# Altium schematic sheet main.SchDoc (part 1 of 3)
size E; SheetNumber: 1; SheetTotal: 2
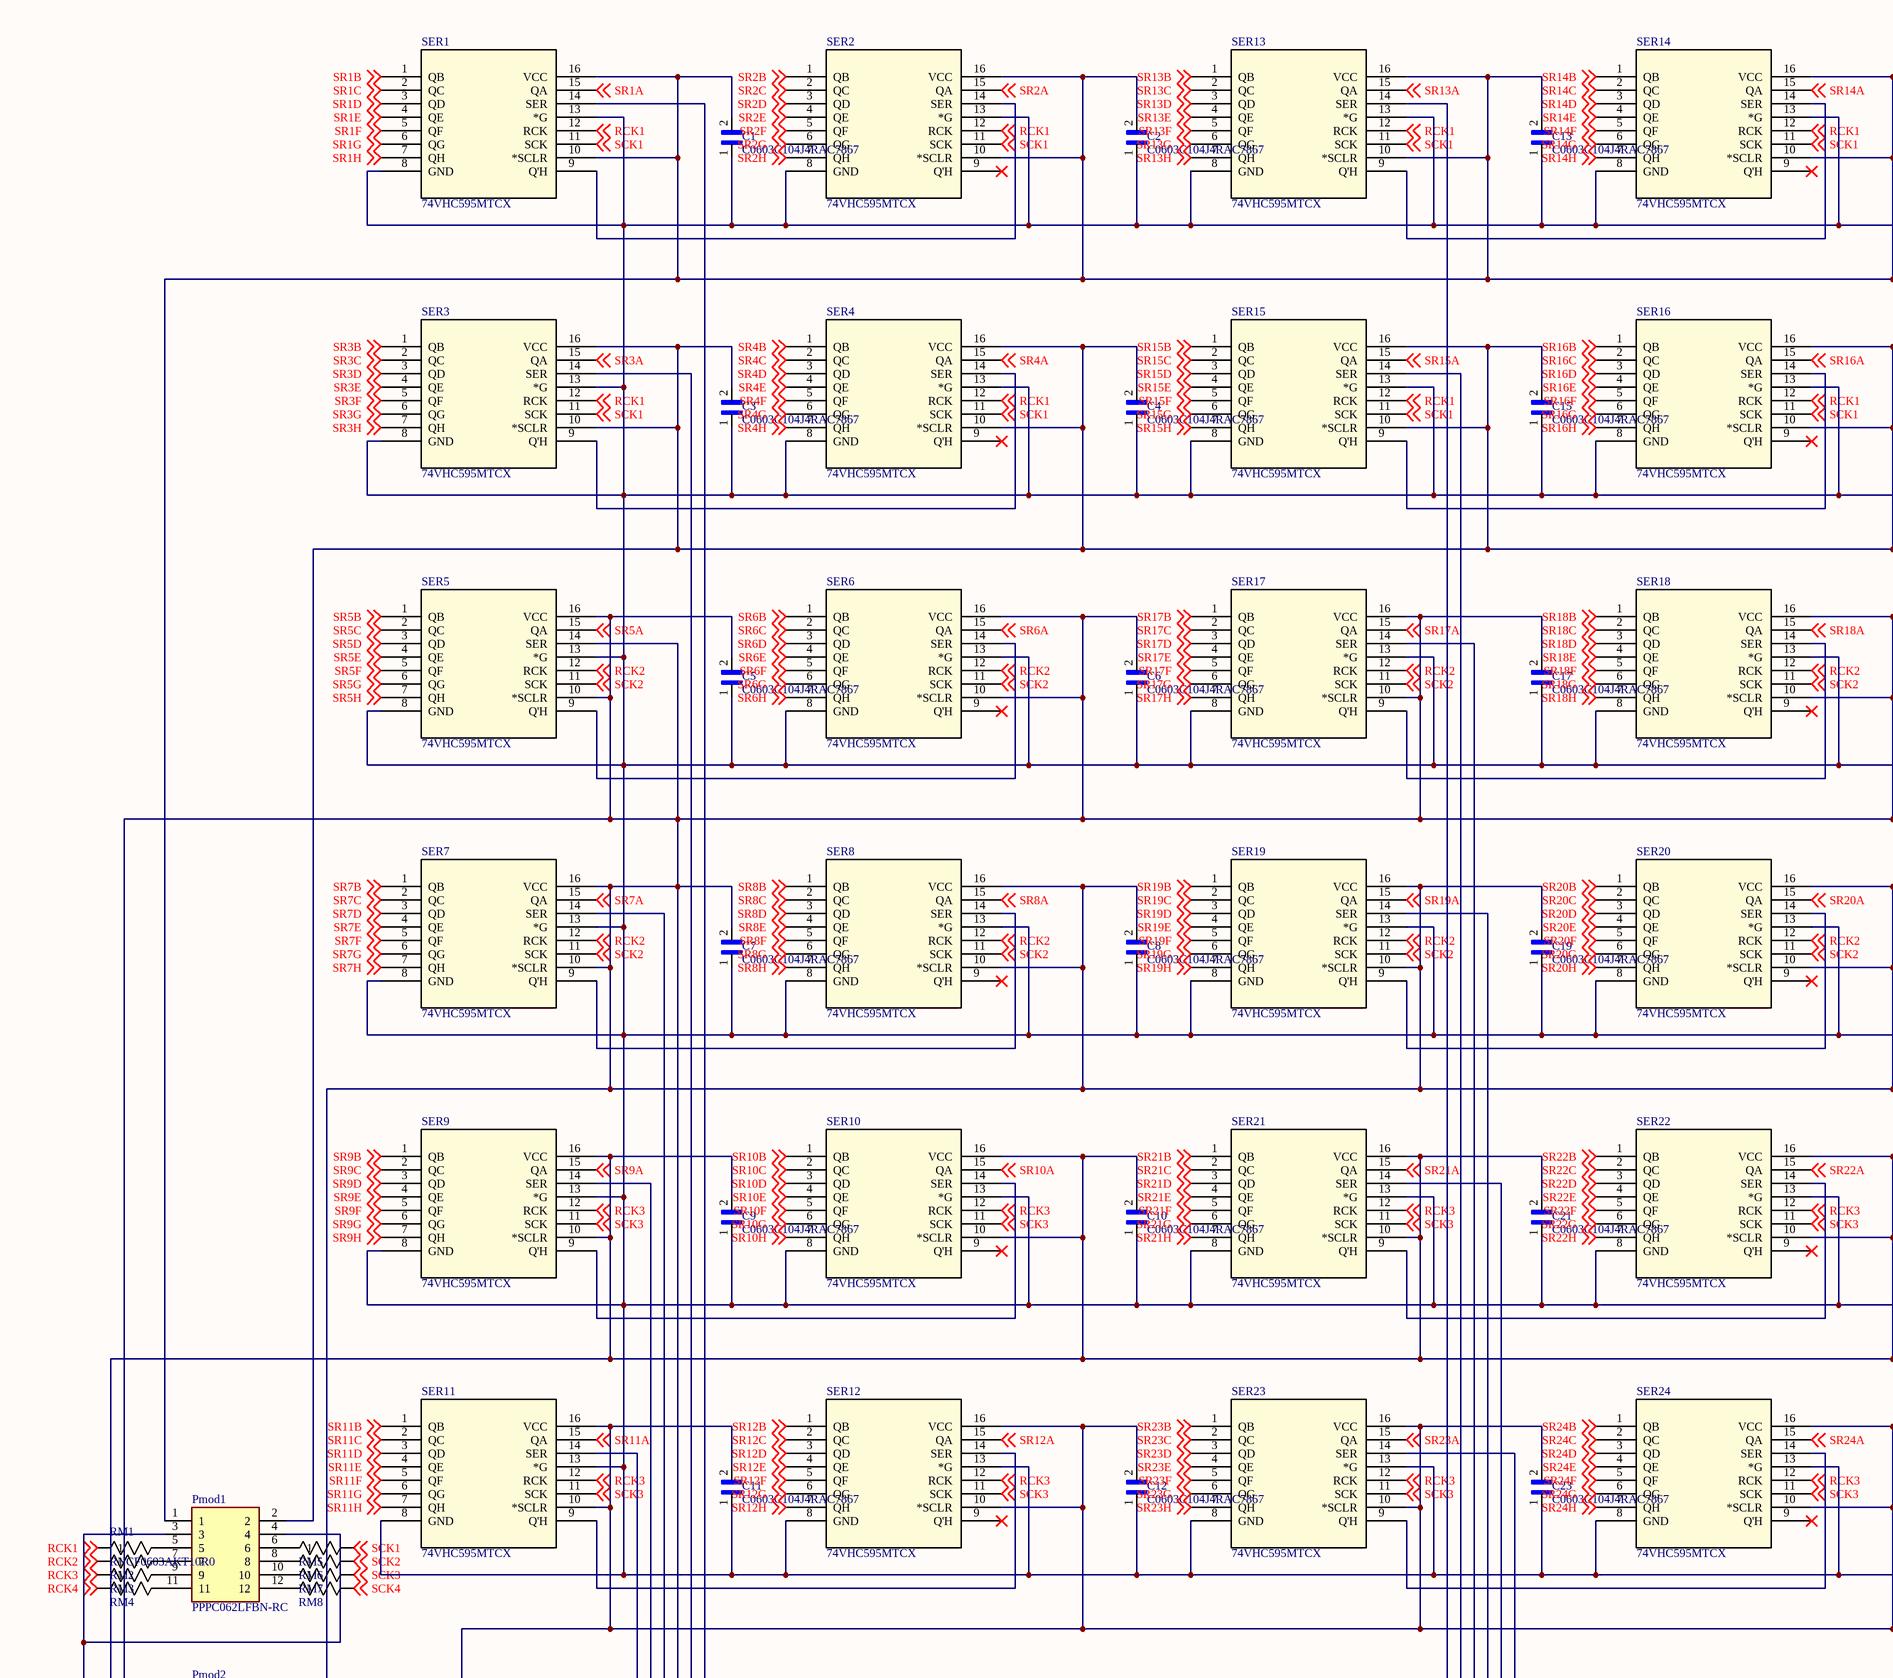
[diagram p0: main.SchDoc, top left]
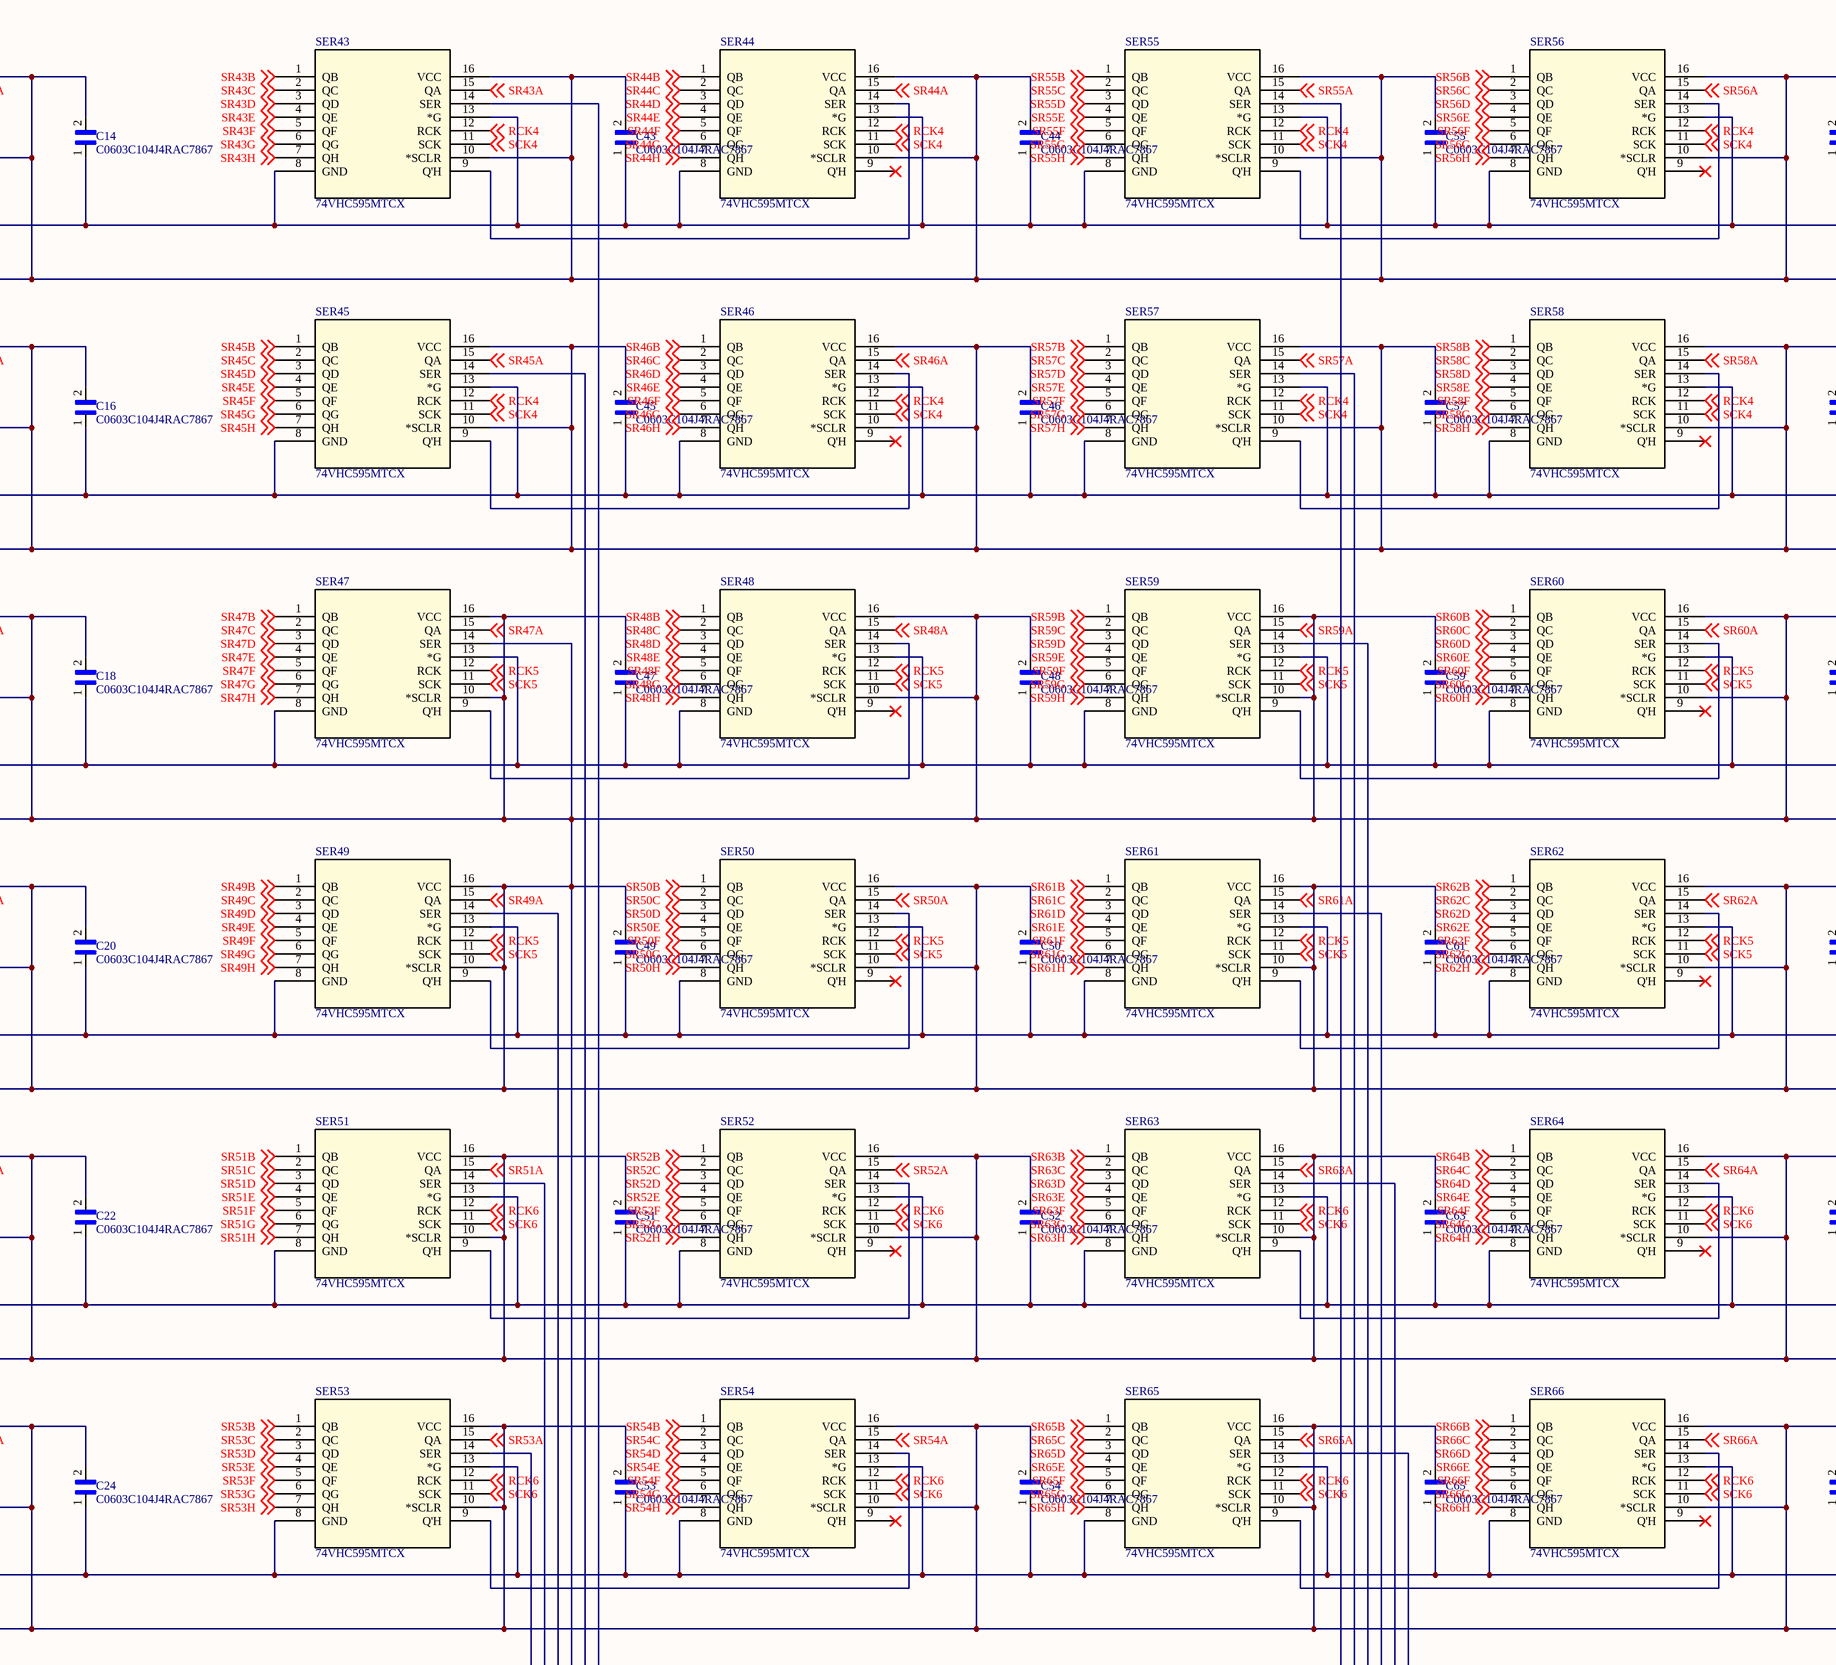
[diagram p1: main.SchDoc, top middle]
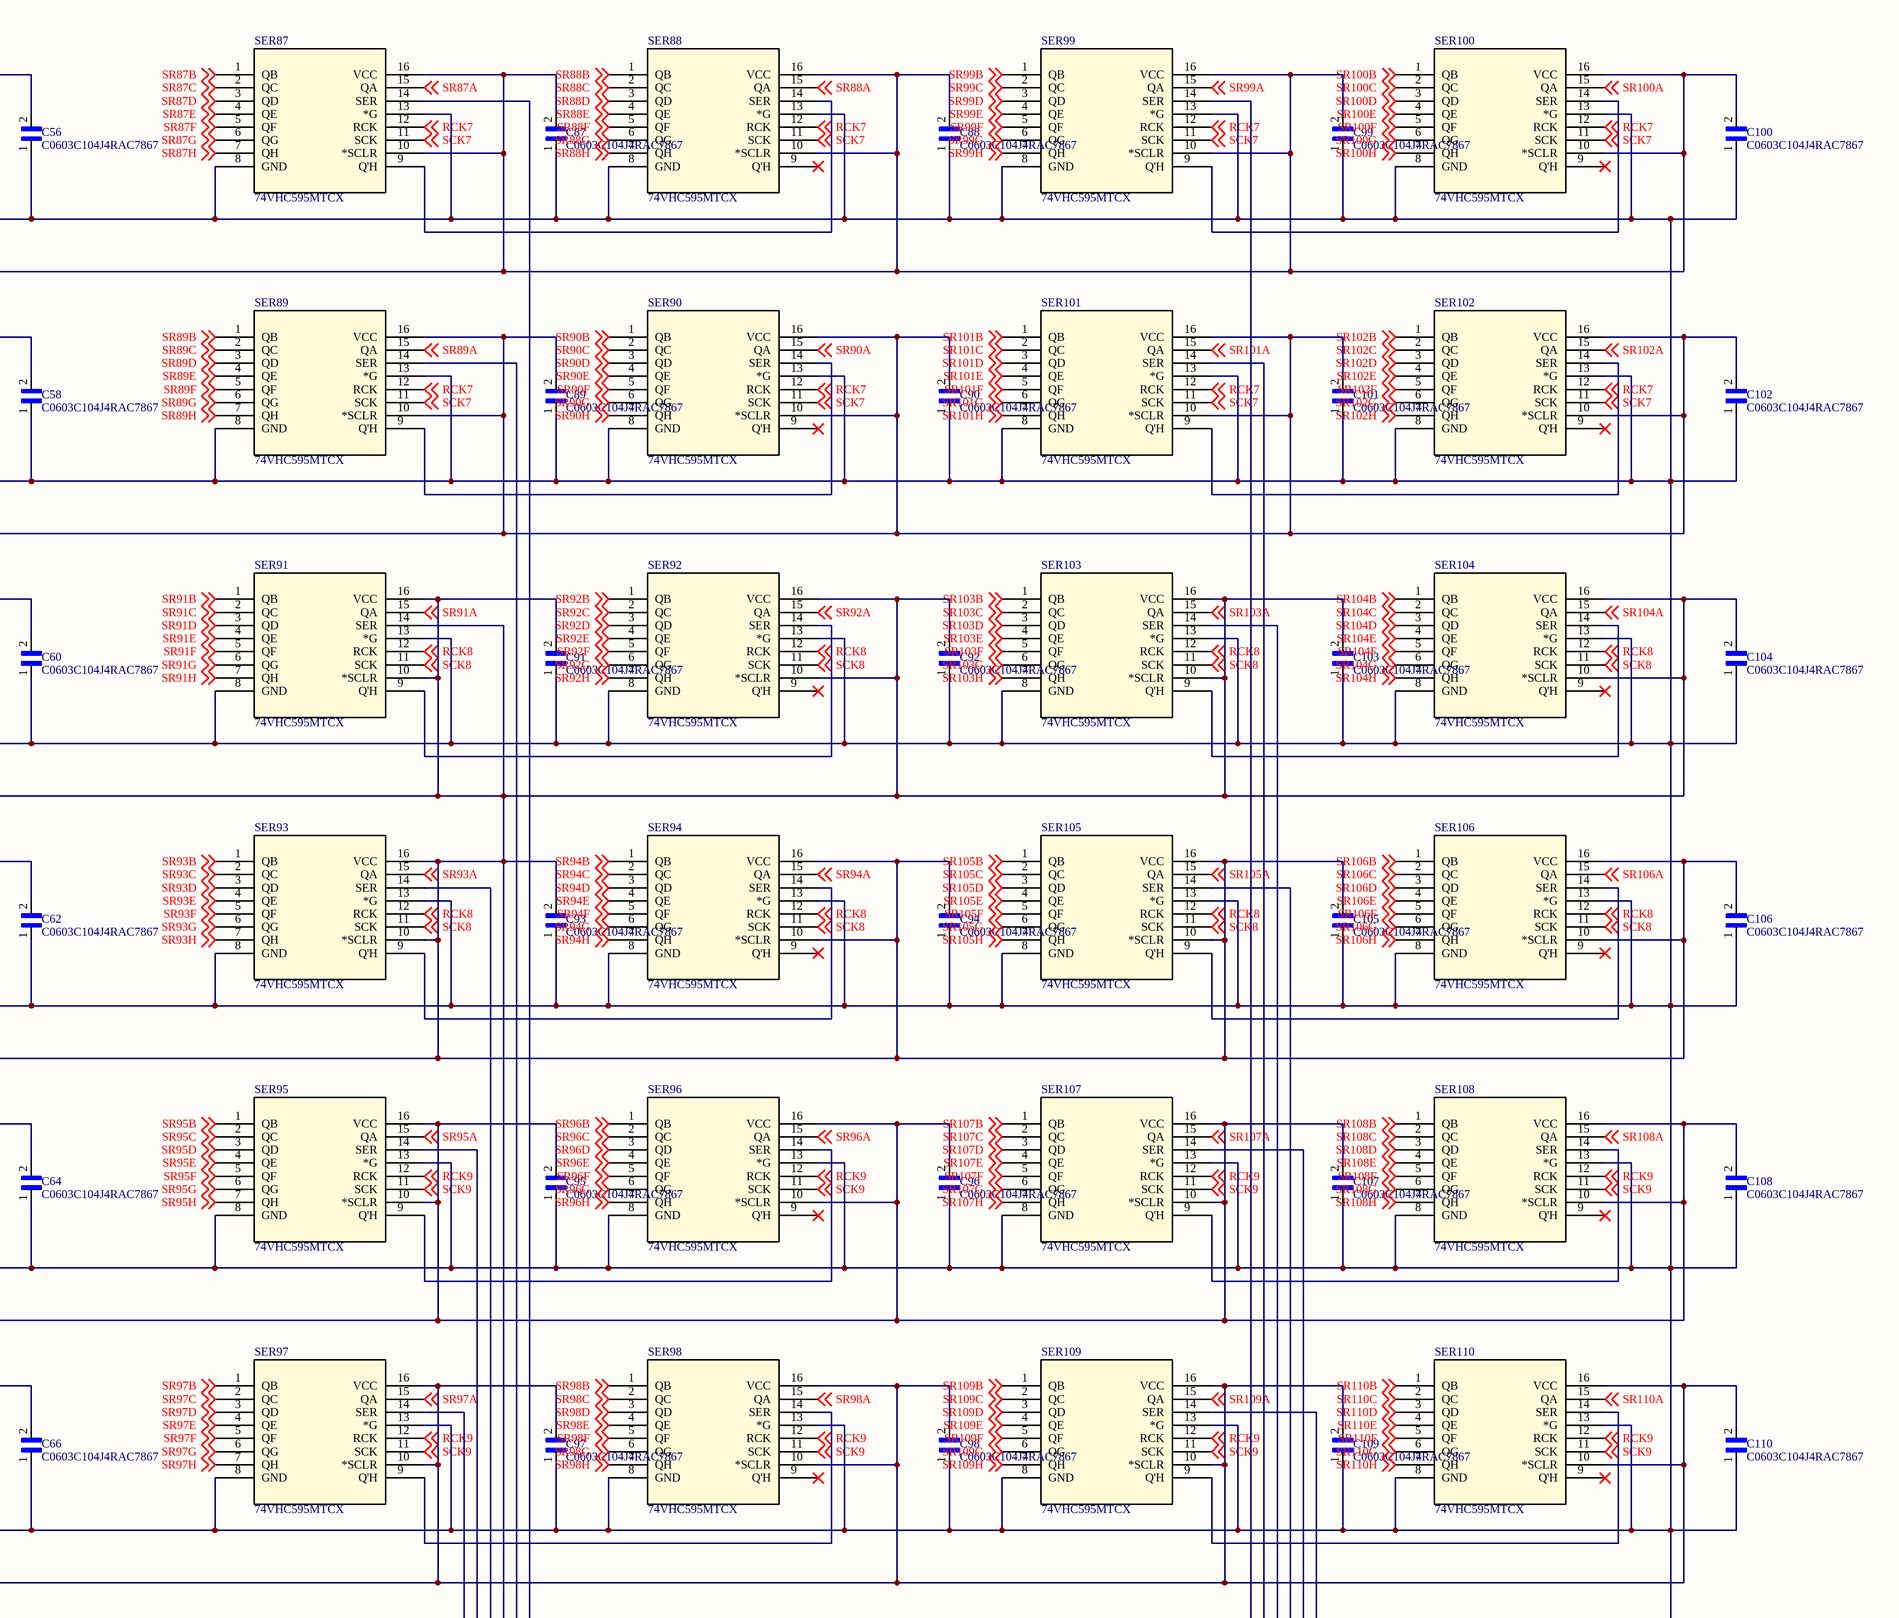
[diagram p2: main.SchDoc, top right]
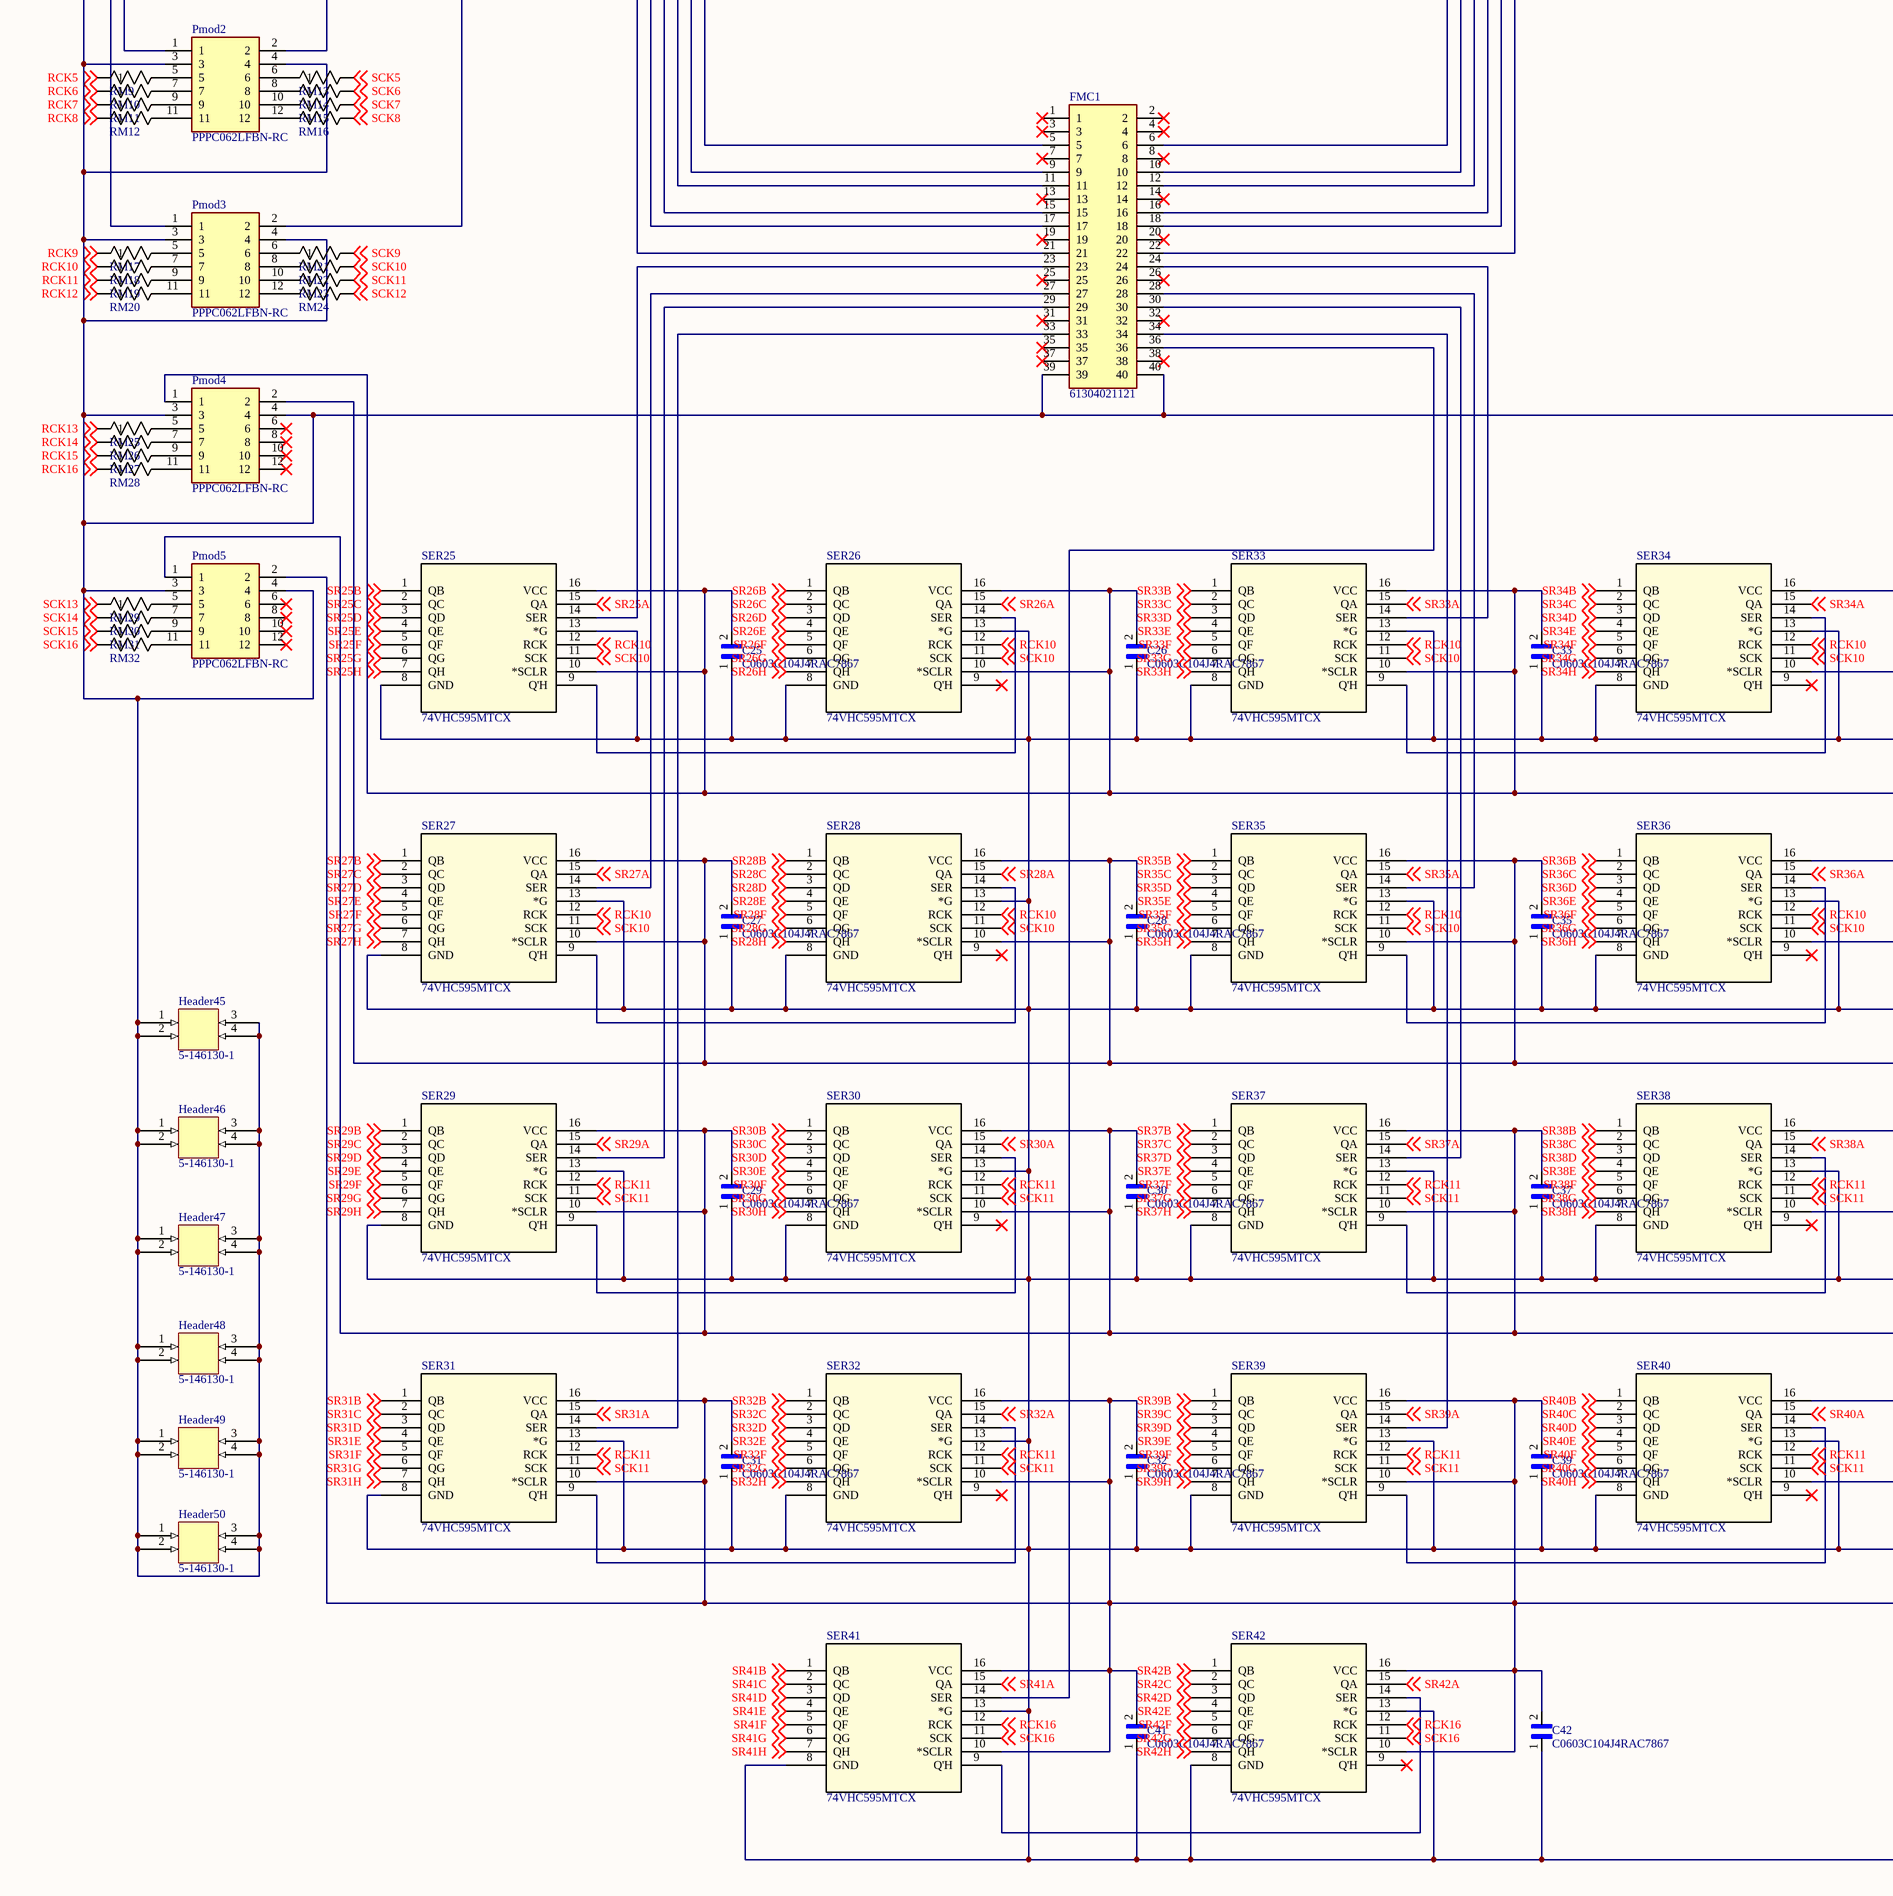
[diagram p3: main.SchDoc, bottom left]
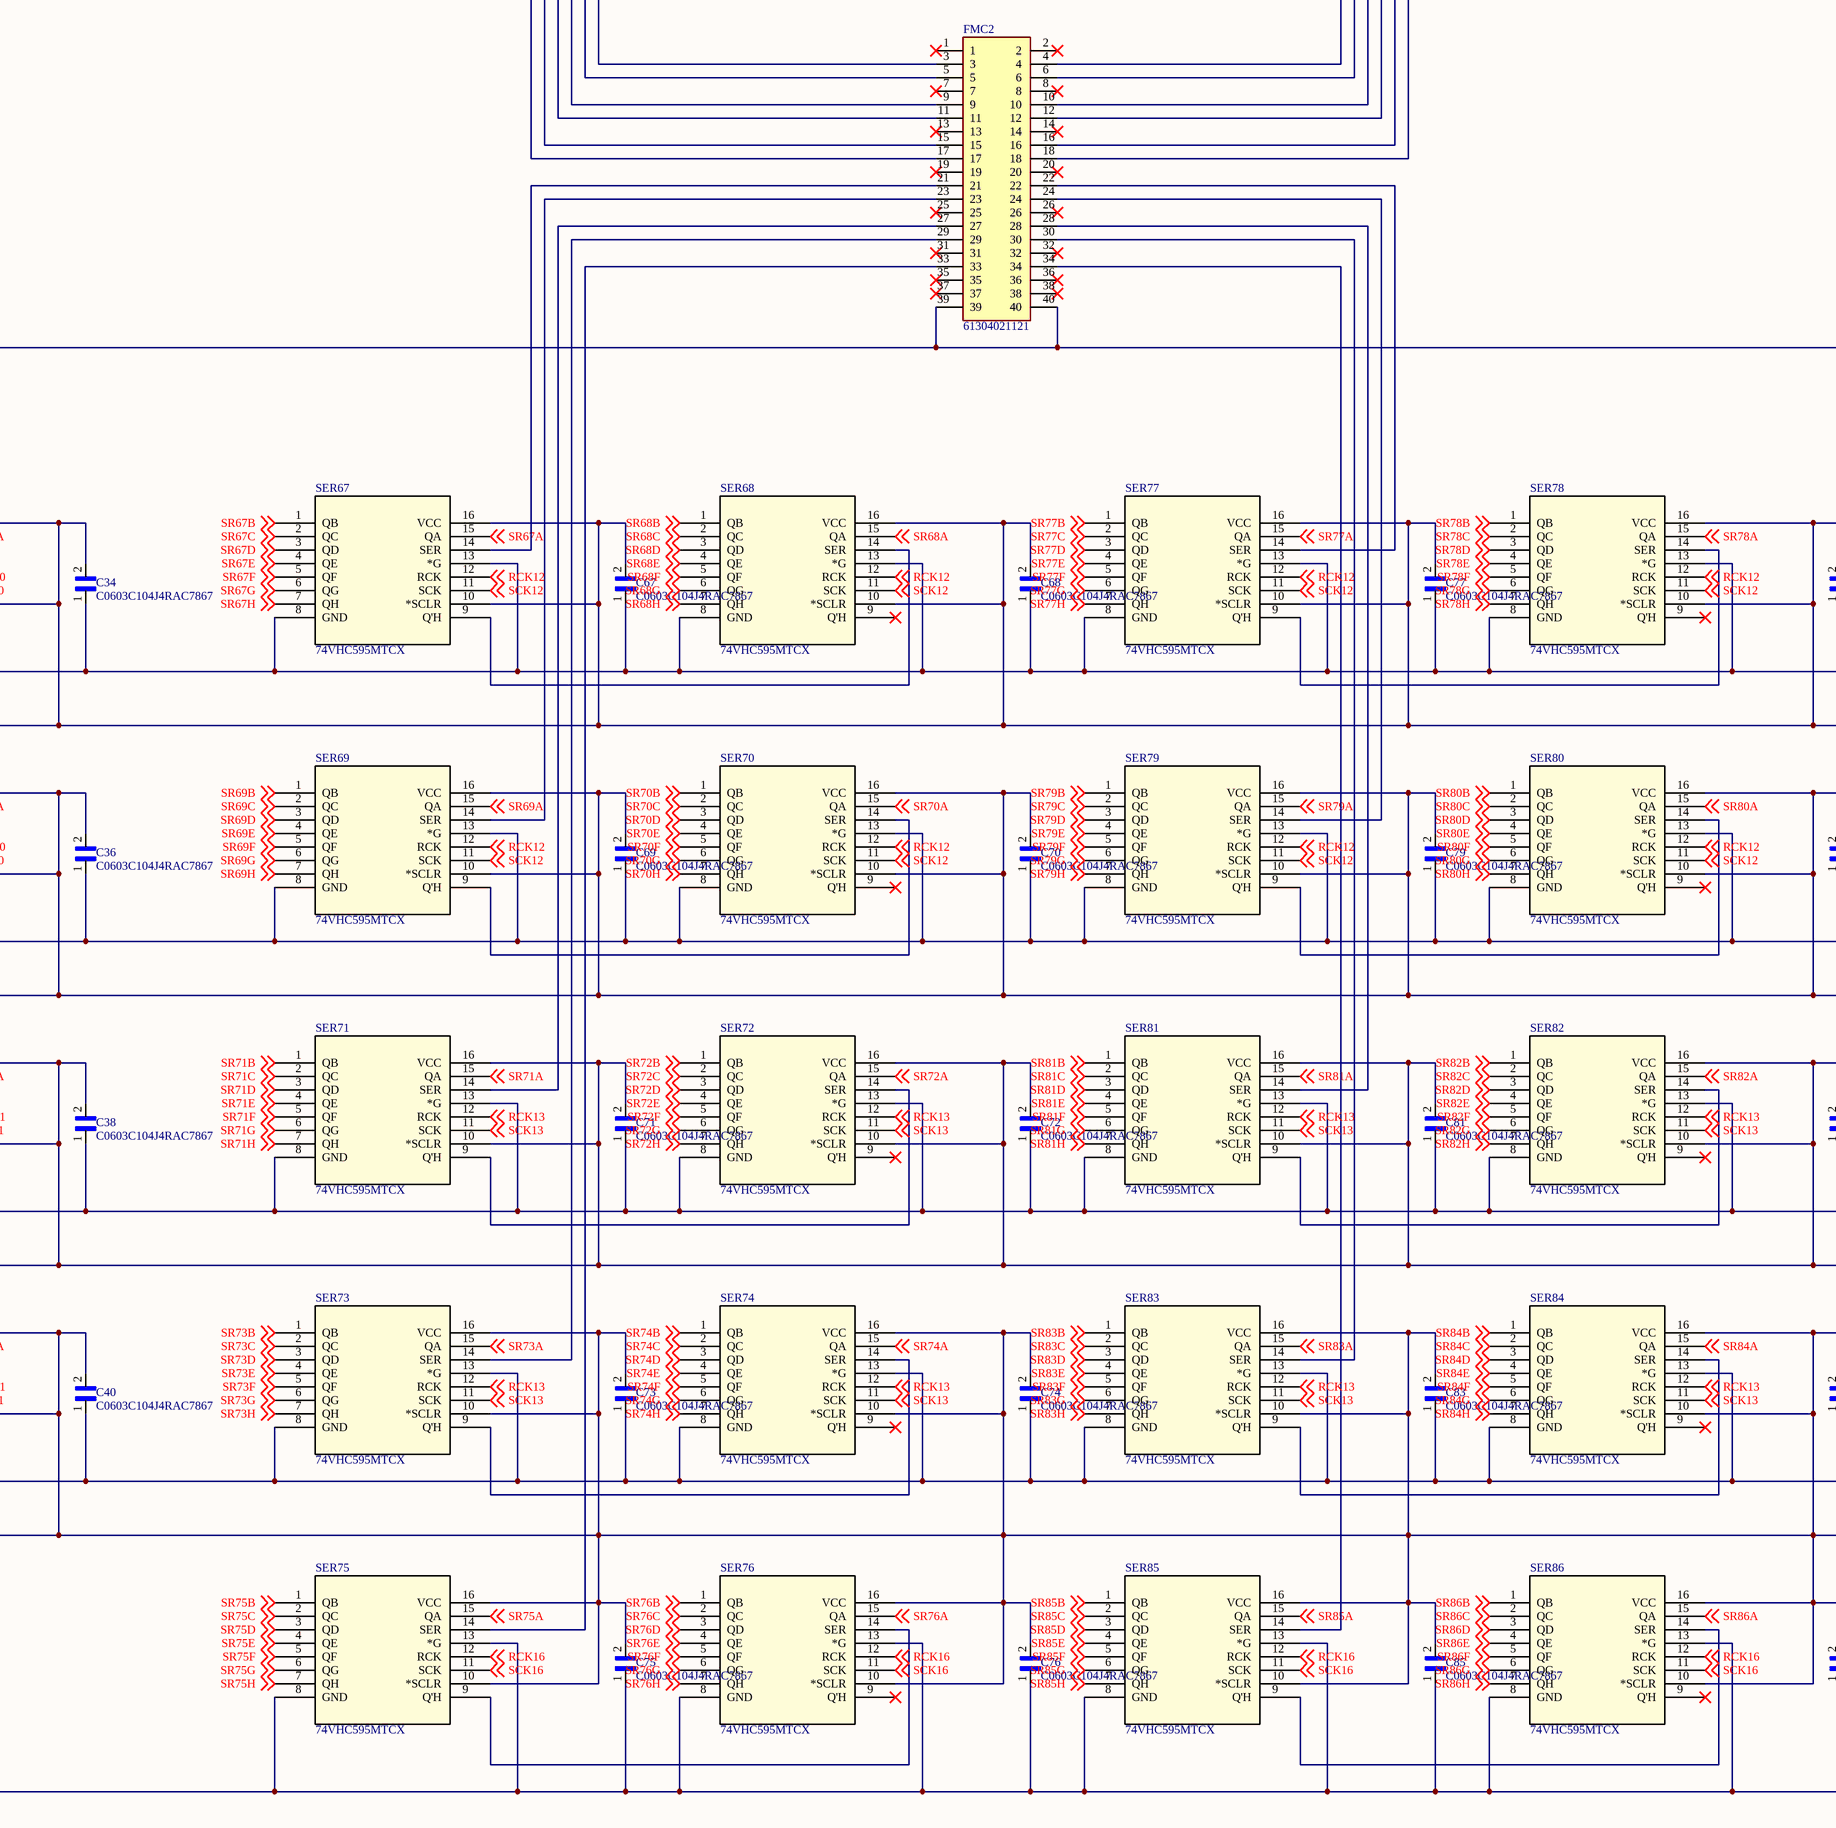
[diagram p4: main.SchDoc, bottom middle]
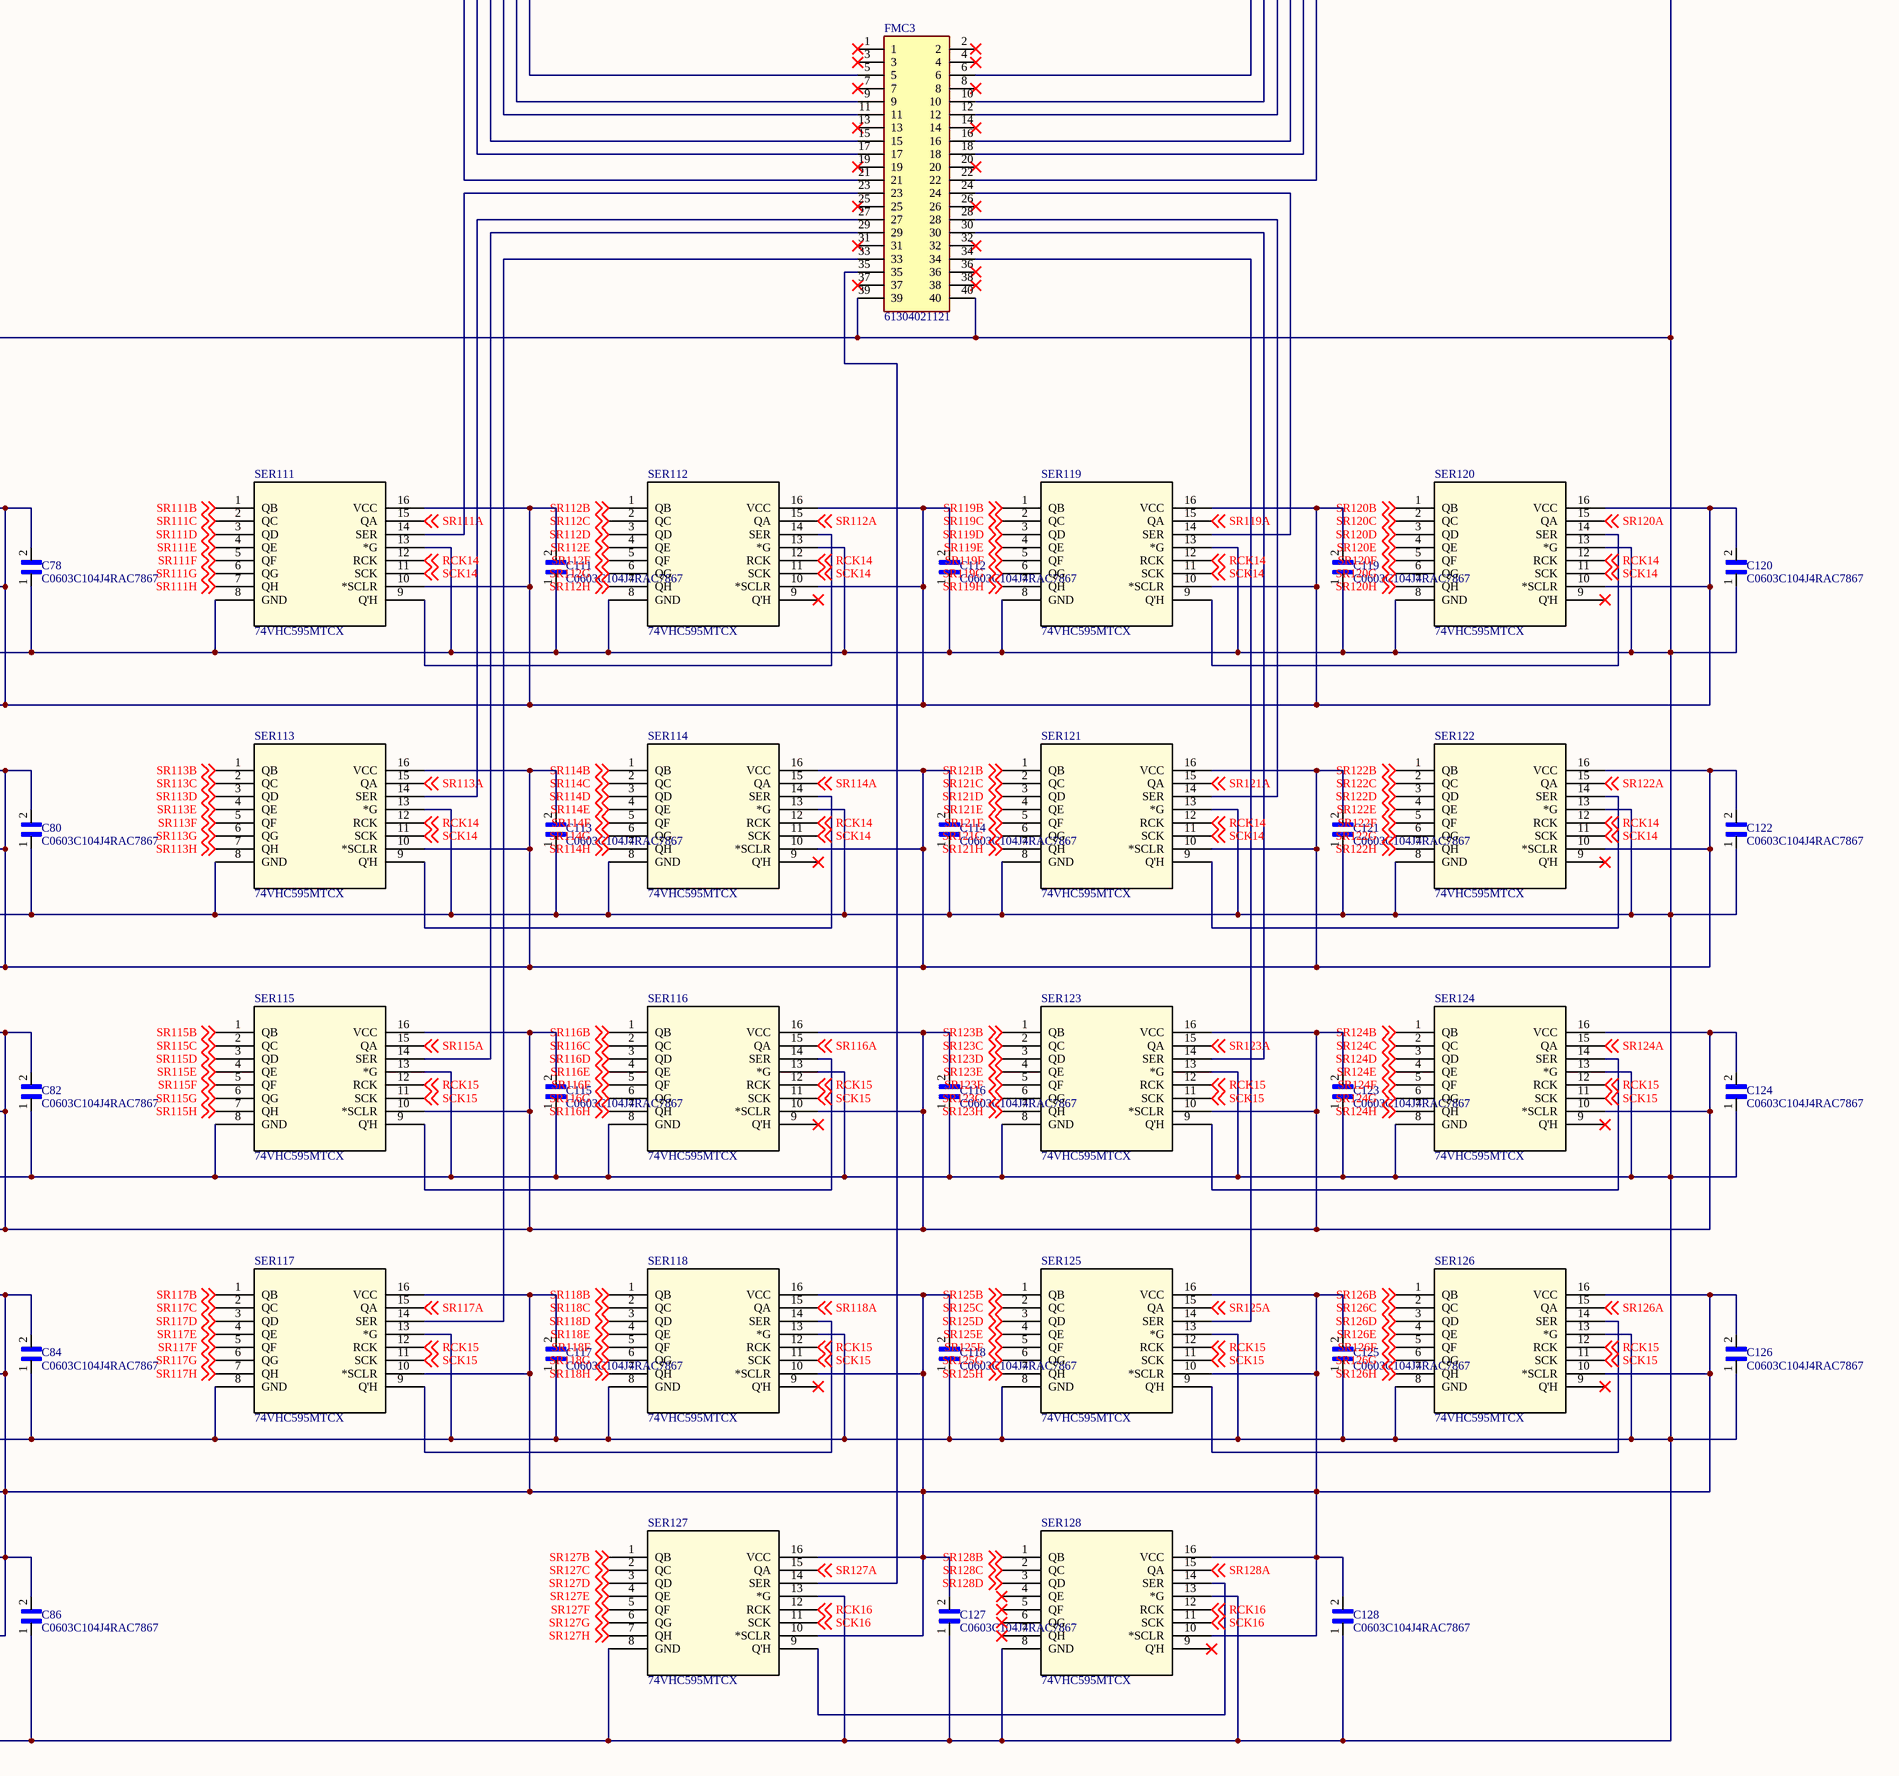
[diagram p5: main.SchDoc, bottom right]

## Parts
C1  C0603C104J4RAC7867  [CAPC1608X90N]
C2  C0603C104J4RAC7867  [CAPC1608X90N]
C3  C0603C104J4RAC7867  [CAPC1608X90N]
C4  C0603C104J4RAC7867  [CAPC1608X90N]
C5  C0603C104J4RAC7867  [CAPC1608X90N]
C6  C0603C104J4RAC7867  [CAPC1608X90N]
C7  C0603C104J4RAC7867  [CAPC1608X90N]
C8  C0603C104J4RAC7867  [CAPC1608X90N]
C9  C0603C104J4RAC7867  [CAPC1608X90N]
C10  C0603C104J4RAC7867  [CAPC1608X90N]
C11  C0603C104J4RAC7867  [CAPC1608X90N]
C12  C0603C104J4RAC7867  [CAPC1608X90N]
C13  C0603C104J4RAC7867  [CAPC1608X90N]
C14  C0603C104J4RAC7867  [CAPC1608X90N]
C15  C0603C104J4RAC7867  [CAPC1608X90N]
C16  C0603C104J4RAC7867  [CAPC1608X90N]
C17  C0603C104J4RAC7867  [CAPC1608X90N]
C18  C0603C104J4RAC7867  [CAPC1608X90N]
C19  C0603C104J4RAC7867  [CAPC1608X90N]
C20  C0603C104J4RAC7867  [CAPC1608X90N]
C21  C0603C104J4RAC7867  [CAPC1608X90N]
C22  C0603C104J4RAC7867  [CAPC1608X90N]
C23  C0603C104J4RAC7867  [CAPC1608X90N]
C24  C0603C104J4RAC7867  [CAPC1608X90N]
C25  C0603C104J4RAC7867  [CAPC1608X90N]
C26  C0603C104J4RAC7867  [CAPC1608X90N]
C27  C0603C104J4RAC7867  [CAPC1608X90N]
C28  C0603C104J4RAC7867  [CAPC1608X90N]
C29  C0603C104J4RAC7867  [CAPC1608X90N]
C30  C0603C104J4RAC7867  [CAPC1608X90N]
C31  C0603C104J4RAC7867  [CAPC1608X90N]
C32  C0603C104J4RAC7867  [CAPC1608X90N]
C33  C0603C104J4RAC7867  [CAPC1608X90N]
C34  C0603C104J4RAC7867  [CAPC1608X90N]
C35  C0603C104J4RAC7867  [CAPC1608X90N]
C36  C0603C104J4RAC7867  [CAPC1608X90N]
C37  C0603C104J4RAC7867  [CAPC1608X90N]
C38  C0603C104J4RAC7867  [CAPC1608X90N]
C39  C0603C104J4RAC7867  [CAPC1608X90N]
C40  C0603C104J4RAC7867  [CAPC1608X90N]
C41  C0603C104J4RAC7867  [CAPC1608X90N]
C42  C0603C104J4RAC7867  [CAPC1608X90N]
C43  C0603C104J4RAC7867  [CAPC1608X90N]
C44  C0603C104J4RAC7867  [CAPC1608X90N]
C45  C0603C104J4RAC7867  [CAPC1608X90N]
C46  C0603C104J4RAC7867  [CAPC1608X90N]
C47  C0603C104J4RAC7867  [CAPC1608X90N]
C48  C0603C104J4RAC7867  [CAPC1608X90N]
C49  C0603C104J4RAC7867  [CAPC1608X90N]
C50  C0603C104J4RAC7867  [CAPC1608X90N]
C51  C0603C104J4RAC7867  [CAPC1608X90N]
C52  C0603C104J4RAC7867  [CAPC1608X90N]
C53  C0603C104J4RAC7867  [CAPC1608X90N]
C54  C0603C104J4RAC7867  [CAPC1608X90N]
C55  C0603C104J4RAC7867  [CAPC1608X90N]
C56  C0603C104J4RAC7867  [CAPC1608X90N]
C57  C0603C104J4RAC7867  [CAPC1608X90N]
C58  C0603C104J4RAC7867  [CAPC1608X90N]
C59  C0603C104J4RAC7867  [CAPC1608X90N]
C60  C0603C104J4RAC7867  [CAPC1608X90N]
C61  C0603C104J4RAC7867  [CAPC1608X90N]
C62  C0603C104J4RAC7867  [CAPC1608X90N]
C63  C0603C104J4RAC7867  [CAPC1608X90N]
C64  C0603C104J4RAC7867  [CAPC1608X90N]
C65  C0603C104J4RAC7867  [CAPC1608X90N]
C66  C0603C104J4RAC7867  [CAPC1608X90N]
C67  C0603C104J4RAC7867  [CAPC1608X90N]
C68  C0603C104J4RAC7867  [CAPC1608X90N]
C69  C0603C104J4RAC7867  [CAPC1608X90N]
C70  C0603C104J4RAC7867  [CAPC1608X90N]
C71  C0603C104J4RAC7867  [CAPC1608X90N]
C72  C0603C104J4RAC7867  [CAPC1608X90N]
C73  C0603C104J4RAC7867  [CAPC1608X90N]
C74  C0603C104J4RAC7867  [CAPC1608X90N]
C75  C0603C104J4RAC7867  [CAPC1608X90N]
C76  C0603C104J4RAC7867  [CAPC1608X90N]
C77  C0603C104J4RAC7867  [CAPC1608X90N]
C78  C0603C104J4RAC7867  [CAPC1608X90N]
C79  C0603C104J4RAC7867  [CAPC1608X90N]
C80  C0603C104J4RAC7867  [CAPC1608X90N]
C81  C0603C104J4RAC7867  [CAPC1608X90N]
C82  C0603C104J4RAC7867  [CAPC1608X90N]
C83  C0603C104J4RAC7867  [CAPC1608X90N]
C84  C0603C104J4RAC7867  [CAPC1608X90N]
C85  C0603C104J4RAC7867  [CAPC1608X90N]
C86  C0603C104J4RAC7867  [CAPC1608X90N]
C87  C0603C104J4RAC7867  [CAPC1608X90N]
C88  C0603C104J4RAC7867  [CAPC1608X90N]
C89  C0603C104J4RAC7867  [CAPC1608X90N]
C90  C0603C104J4RAC7867  [CAPC1608X90N]
C91  C0603C104J4RAC7867  [CAPC1608X90N]
C92  C0603C104J4RAC7867  [CAPC1608X90N]
C93  C0603C104J4RAC7867  [CAPC1608X90N]
C94  C0603C104J4RAC7867  [CAPC1608X90N]
C95  C0603C104J4RAC7867  [CAPC1608X90N]
C96  C0603C104J4RAC7867  [CAPC1608X90N]
C97  C0603C104J4RAC7867  [CAPC1608X90N]
C98  C0603C104J4RAC7867  [CAPC1608X90N]
C99  C0603C104J4RAC7867  [CAPC1608X90N]
C100  C0603C104J4RAC7867  [CAPC1608X90N]
C101  C0603C104J4RAC7867  [CAPC1608X90N]
C102  C0603C104J4RAC7867  [CAPC1608X90N]
C103  C0603C104J4RAC7867  [CAPC1608X90N]
C104  C0603C104J4RAC7867  [CAPC1608X90N]
C105  C0603C104J4RAC7867  [CAPC1608X90N]
C106  C0603C104J4RAC7867  [CAPC1608X90N]
C107  C0603C104J4RAC7867  [CAPC1608X90N]
C108  C0603C104J4RAC7867  [CAPC1608X90N]
C109  C0603C104J4RAC7867  [CAPC1608X90N]
C110  C0603C104J4RAC7867  [CAPC1608X90N]
C111  C0603C104J4RAC7867  [CAPC1608X90N]
C112  C0603C104J4RAC7867  [CAPC1608X90N]
C113  C0603C104J4RAC7867  [CAPC1608X90N]
C114  C0603C104J4RAC7867  [CAPC1608X90N]
C115  C0603C104J4RAC7867  [CAPC1608X90N]
C116  C0603C104J4RAC7867  [CAPC1608X90N]
C117  C0603C104J4RAC7867  [CAPC1608X90N]
C118  C0603C104J4RAC7867  [CAPC1608X90N]
C119  C0603C104J4RAC7867  [CAPC1608X90N]
C120  C0603C104J4RAC7867  [CAPC1608X90N]
C121  C0603C104J4RAC7867  [CAPC1608X90N]
C122  C0603C104J4RAC7867  [CAPC1608X90N]
C123  C0603C104J4RAC7867  [CAPC1608X90N]
C124  C0603C104J4RAC7867  [CAPC1608X90N]
C125  C0603C104J4RAC7867  [CAPC1608X90N]
C126  C0603C104J4RAC7867  [CAPC1608X90N]
C127  C0603C104J4RAC7867  [CAPC1608X90N]
C128  C0603C104J4RAC7867  [CAPC1608X90N]
FMC1  61304021121  [HDRV40W64P254X254_2X20_5080X508X869P]
FMC2  61304021121  [HDRV40W64P254X254_2X20_5080X508X869P]
FMC3  61304021121  [HDRV40W64P254X254_2X20_5080X508X869P]
Header45  5-146130-1  [CONN_5-146130-7_TYCO - duplicate - duplicate - duplicate - duplicate]
Header46  5-146130-1  [CONN_5-146130-7_TYCO - duplicate - duplicate - duplicate - duplicate]
Header47  5-146130-1  [CONN_5-146130-7_TYCO - duplicate - duplicate - duplicate - duplicate]
Header48  5-146130-1  [CONN_5-146130-7_TYCO - duplicate - duplicate - duplicate - duplicate]
Header49  5-146130-1  [CONN_5-146130-7_TYCO - duplicate - duplicate - duplicate - duplicate]
Header50  5-146130-1  [CONN_5-146130-7_TYCO - duplicate - duplicate - duplicate - duplicate]
Pmod1  PPPC062LFBN-RC  [RHDR12W80P254_2X6_1574X508X850P]
Pmod2  PPPC062LFBN-RC  [RHDR12W80P254_2X6_1574X508X850P]
Pmod3  PPPC062LFBN-RC  [RHDR12W80P254_2X6_1574X508X850P]
Pmod4  PPPC062LFBN-RC  [RHDR12W80P254_2X6_1574X508X850P]
Pmod5  PPPC062LFBN-RC  [RHDR12W80P254_2X6_1574X508X850P]
RM1  RNCF0603AKT10R0  [RES_RNCF0603_STP]
RM2  RNCF0603AKT10R0  [RES_RNCF0603_STP]  (value not drawn)
RM3  RNCF0603AKT10R0  [RES_RNCF0603_STP]  (value not drawn)
RM4  RNCF0603AKT10R0  [RES_RNCF0603_STP]  (value not drawn)
RM5  RNCF0603AKT10R0  [RES_RNCF0603_STP]  (value not drawn)
RM6  RNCF0603AKT10R0  [RES_RNCF0603_STP]  (value not drawn)
RM7  RNCF0603AKT10R0  [RES_RNCF0603_STP]  (value not drawn)
RM8  RNCF0603AKT10R0  [RES_RNCF0603_STP]  (value not drawn)
RM9  RNCF0603AKT10R0  [RES_RNCF0603_STP]  (value not drawn)
RM10  RNCF0603AKT10R0  [RES_RNCF0603_STP]  (value not drawn)
RM11  RNCF0603AKT10R0  [RES_RNCF0603_STP]  (value not drawn)
RM12  RNCF0603AKT10R0  [RES_RNCF0603_STP]  (value not drawn)
RM13  RNCF0603AKT10R0  [RES_RNCF0603_STP]  (value not drawn)
RM14  RNCF0603AKT10R0  [RES_RNCF0603_STP]  (value not drawn)
RM15  RNCF0603AKT10R0  [RES_RNCF0603_STP]  (value not drawn)
RM16  RNCF0603AKT10R0  [RES_RNCF0603_STP]  (value not drawn)
RM17  RNCF0603AKT10R0  [RES_RNCF0603_STP]  (value not drawn)
RM18  RNCF0603AKT10R0  [RES_RNCF0603_STP]  (value not drawn)
RM19  RNCF0603AKT10R0  [RES_RNCF0603_STP]  (value not drawn)
RM20  RNCF0603AKT10R0  [RES_RNCF0603_STP]  (value not drawn)
RM21  RNCF0603AKT10R0  [RES_RNCF0603_STP]  (value not drawn)
RM22  RNCF0603AKT10R0  [RES_RNCF0603_STP]  (value not drawn)
RM23  RNCF0603AKT10R0  [RES_RNCF0603_STP]  (value not drawn)
RM24  RNCF0603AKT10R0  [RES_RNCF0603_STP]  (value not drawn)
RM25  RNCF0603AKT10R0  [RES_RNCF0603_STP]  (value not drawn)
RM26  RNCF0603AKT10R0  [RES_RNCF0603_STP]  (value not drawn)
RM27  RNCF0603AKT10R0  [RES_RNCF0603_STP]  (value not drawn)
RM28  RNCF0603AKT10R0  [RES_RNCF0603_STP]  (value not drawn)
RM29  RNCF0603AKT10R0  [RES_RNCF0603_STP]  (value not drawn)
RM30  RNCF0603AKT10R0  [RES_RNCF0603_STP]  (value not drawn)
RM31  RNCF0603AKT10R0  [RES_RNCF0603_STP]  (value not drawn)
RM32  RNCF0603AKT10R0  [RES_RNCF0603_STP]  (value not drawn)
SER1  74VHC595MTCX  [TSSOP16_5X4P5_ONS]
SER2  74VHC595MTCX  [TSSOP16_5X4P5_ONS]
SER3  74VHC595MTCX  [TSSOP16_5X4P5_ONS]
SER4  74VHC595MTCX  [TSSOP16_5X4P5_ONS]
SER5  74VHC595MTCX  [TSSOP16_5X4P5_ONS]
SER6  74VHC595MTCX  [TSSOP16_5X4P5_ONS]
SER7  74VHC595MTCX  [TSSOP16_5X4P5_ONS]
SER8  74VHC595MTCX  [TSSOP16_5X4P5_ONS]
SER9  74VHC595MTCX  [TSSOP16_5X4P5_ONS]
SER10  74VHC595MTCX  [TSSOP16_5X4P5_ONS]
SER11  74VHC595MTCX  [TSSOP16_5X4P5_ONS]
SER12  74VHC595MTCX  [TSSOP16_5X4P5_ONS]
SER13  74VHC595MTCX  [TSSOP16_5X4P5_ONS]
SER14  74VHC595MTCX  [TSSOP16_5X4P5_ONS]
SER15  74VHC595MTCX  [TSSOP16_5X4P5_ONS]
SER16  74VHC595MTCX  [TSSOP16_5X4P5_ONS]
SER17  74VHC595MTCX  [TSSOP16_5X4P5_ONS]
SER18  74VHC595MTCX  [TSSOP16_5X4P5_ONS]
SER19  74VHC595MTCX  [TSSOP16_5X4P5_ONS]
SER20  74VHC595MTCX  [TSSOP16_5X4P5_ONS]
SER21  74VHC595MTCX  [TSSOP16_5X4P5_ONS]
SER22  74VHC595MTCX  [TSSOP16_5X4P5_ONS]
SER23  74VHC595MTCX  [TSSOP16_5X4P5_ONS]
SER24  74VHC595MTCX  [TSSOP16_5X4P5_ONS]
SER25  74VHC595MTCX  [TSSOP16_5X4P5_ONS]
SER26  74VHC595MTCX  [TSSOP16_5X4P5_ONS]
SER27  74VHC595MTCX  [TSSOP16_5X4P5_ONS]
SER28  74VHC595MTCX  [TSSOP16_5X4P5_ONS]
SER29  74VHC595MTCX  [TSSOP16_5X4P5_ONS]
SER30  74VHC595MTCX  [TSSOP16_5X4P5_ONS]
SER31  74VHC595MTCX  [TSSOP16_5X4P5_ONS]
SER32  74VHC595MTCX  [TSSOP16_5X4P5_ONS]
SER33  74VHC595MTCX  [TSSOP16_5X4P5_ONS]
SER34  74VHC595MTCX  [TSSOP16_5X4P5_ONS]
SER35  74VHC595MTCX  [TSSOP16_5X4P5_ONS]
SER36  74VHC595MTCX  [TSSOP16_5X4P5_ONS]
SER37  74VHC595MTCX  [TSSOP16_5X4P5_ONS]
SER38  74VHC595MTCX  [TSSOP16_5X4P5_ONS]
SER39  74VHC595MTCX  [TSSOP16_5X4P5_ONS]
SER40  74VHC595MTCX  [TSSOP16_5X4P5_ONS]
SER41  74VHC595MTCX  [TSSOP16_5X4P5_ONS]
SER42  74VHC595MTCX  [TSSOP16_5X4P5_ONS]
SER43  74VHC595MTCX  [TSSOP16_5X4P5_ONS]
SER44  74VHC595MTCX  [TSSOP16_5X4P5_ONS]
SER45  74VHC595MTCX  [TSSOP16_5X4P5_ONS]
SER46  74VHC595MTCX  [TSSOP16_5X4P5_ONS]
SER47  74VHC595MTCX  [TSSOP16_5X4P5_ONS]
SER48  74VHC595MTCX  [TSSOP16_5X4P5_ONS]
SER49  74VHC595MTCX  [TSSOP16_5X4P5_ONS]
SER50  74VHC595MTCX  [TSSOP16_5X4P5_ONS]
SER51  74VHC595MTCX  [TSSOP16_5X4P5_ONS]
SER52  74VHC595MTCX  [TSSOP16_5X4P5_ONS]
SER53  74VHC595MTCX  [TSSOP16_5X4P5_ONS]
SER54  74VHC595MTCX  [TSSOP16_5X4P5_ONS]
SER55  74VHC595MTCX  [TSSOP16_5X4P5_ONS]
SER56  74VHC595MTCX  [TSSOP16_5X4P5_ONS]
SER57  74VHC595MTCX  [TSSOP16_5X4P5_ONS]
SER58  74VHC595MTCX  [TSSOP16_5X4P5_ONS]
SER59  74VHC595MTCX  [TSSOP16_5X4P5_ONS]
SER60  74VHC595MTCX  [TSSOP16_5X4P5_ONS]
SER61  74VHC595MTCX  [TSSOP16_5X4P5_ONS]
SER62  74VHC595MTCX  [TSSOP16_5X4P5_ONS]
SER63  74VHC595MTCX  [TSSOP16_5X4P5_ONS]
SER64  74VHC595MTCX  [TSSOP16_5X4P5_ONS]
SER65  74VHC595MTCX  [TSSOP16_5X4P5_ONS]
SER66  74VHC595MTCX  [TSSOP16_5X4P5_ONS]
SER67  74VHC595MTCX  [TSSOP16_5X4P5_ONS]
SER68  74VHC595MTCX  [TSSOP16_5X4P5_ONS]
SER69  74VHC595MTCX  [TSSOP16_5X4P5_ONS]
SER70  74VHC595MTCX  [TSSOP16_5X4P5_ONS]
SER71  74VHC595MTCX  [TSSOP16_5X4P5_ONS]
SER72  74VHC595MTCX  [TSSOP16_5X4P5_ONS]
SER73  74VHC595MTCX  [TSSOP16_5X4P5_ONS]
SER74  74VHC595MTCX  [TSSOP16_5X4P5_ONS]
SER75  74VHC595MTCX  [TSSOP16_5X4P5_ONS]
SER76  74VHC595MTCX  [TSSOP16_5X4P5_ONS]
SER77  74VHC595MTCX  [TSSOP16_5X4P5_ONS]
SER78  74VHC595MTCX  [TSSOP16_5X4P5_ONS]
SER79  74VHC595MTCX  [TSSOP16_5X4P5_ONS]
SER80  74VHC595MTCX  [TSSOP16_5X4P5_ONS]
SER81  74VHC595MTCX  [TSSOP16_5X4P5_ONS]
SER82  74VHC595MTCX  [TSSOP16_5X4P5_ONS]
SER83  74VHC595MTCX  [TSSOP16_5X4P5_ONS]
SER84  74VHC595MTCX  [TSSOP16_5X4P5_ONS]
SER85  74VHC595MTCX  [TSSOP16_5X4P5_ONS]
SER86  74VHC595MTCX  [TSSOP16_5X4P5_ONS]
SER87  74VHC595MTCX  [TSSOP16_5X4P5_ONS]
SER88  74VHC595MTCX  [TSSOP16_5X4P5_ONS]
SER89  74VHC595MTCX  [TSSOP16_5X4P5_ONS]
SER90  74VHC595MTCX  [TSSOP16_5X4P5_ONS]
SER91  74VHC595MTCX  [TSSOP16_5X4P5_ONS]
SER92  74VHC595MTCX  [TSSOP16_5X4P5_ONS]
SER93  74VHC595MTCX  [TSSOP16_5X4P5_ONS]
SER94  74VHC595MTCX  [TSSOP16_5X4P5_ONS]
SER95  74VHC595MTCX  [TSSOP16_5X4P5_ONS]
SER96  74VHC595MTCX  [TSSOP16_5X4P5_ONS]
SER97  74VHC595MTCX  [TSSOP16_5X4P5_ONS]
SER98  74VHC595MTCX  [TSSOP16_5X4P5_ONS]
SER99  74VHC595MTCX  [TSSOP16_5X4P5_ONS]
SER100  74VHC595MTCX  [TSSOP16_5X4P5_ONS]
SER101  74VHC595MTCX  [TSSOP16_5X4P5_ONS]
SER102  74VHC595MTCX  [TSSOP16_5X4P5_ONS]
SER103  74VHC595MTCX  [TSSOP16_5X4P5_ONS]
SER104  74VHC595MTCX  [TSSOP16_5X4P5_ONS]
SER105  74VHC595MTCX  [TSSOP16_5X4P5_ONS]
SER106  74VHC595MTCX  [TSSOP16_5X4P5_ONS]
SER107  74VHC595MTCX  [TSSOP16_5X4P5_ONS]
SER108  74VHC595MTCX  [TSSOP16_5X4P5_ONS]
SER109  74VHC595MTCX  [TSSOP16_5X4P5_ONS]
SER110  74VHC595MTCX  [TSSOP16_5X4P5_ONS]
SER111  74VHC595MTCX  [TSSOP16_5X4P5_ONS]
SER112  74VHC595MTCX  [TSSOP16_5X4P5_ONS]
SER113  74VHC595MTCX  [TSSOP16_5X4P5_ONS]
SER114  74VHC595MTCX  [TSSOP16_5X4P5_ONS]
SER115  74VHC595MTCX  [TSSOP16_5X4P5_ONS]
SER116  74VHC595MTCX  [TSSOP16_5X4P5_ONS]
SER117  74VHC595MTCX  [TSSOP16_5X4P5_ONS]
SER118  74VHC595MTCX  [TSSOP16_5X4P5_ONS]
SER119  74VHC595MTCX  [TSSOP16_5X4P5_ONS]
SER120  74VHC595MTCX  [TSSOP16_5X4P5_ONS]
SER121  74VHC595MTCX  [TSSOP16_5X4P5_ONS]
SER122  74VHC595MTCX  [TSSOP16_5X4P5_ONS]
SER123  74VHC595MTCX  [TSSOP16_5X4P5_ONS]
SER124  74VHC595MTCX  [TSSOP16_5X4P5_ONS]
SER125  74VHC595MTCX  [TSSOP16_5X4P5_ONS]
SER126  74VHC595MTCX  [TSSOP16_5X4P5_ONS]
SER127  74VHC595MTCX  [TSSOP16_5X4P5_ONS]
SER128  74VHC595MTCX  [TSSOP16_5X4P5_ONS]